# EAGLE design MCB-MTS-Dragonfly-v2.0.0 (EAGLE 7.7.0)

## Sheet 1 of 2
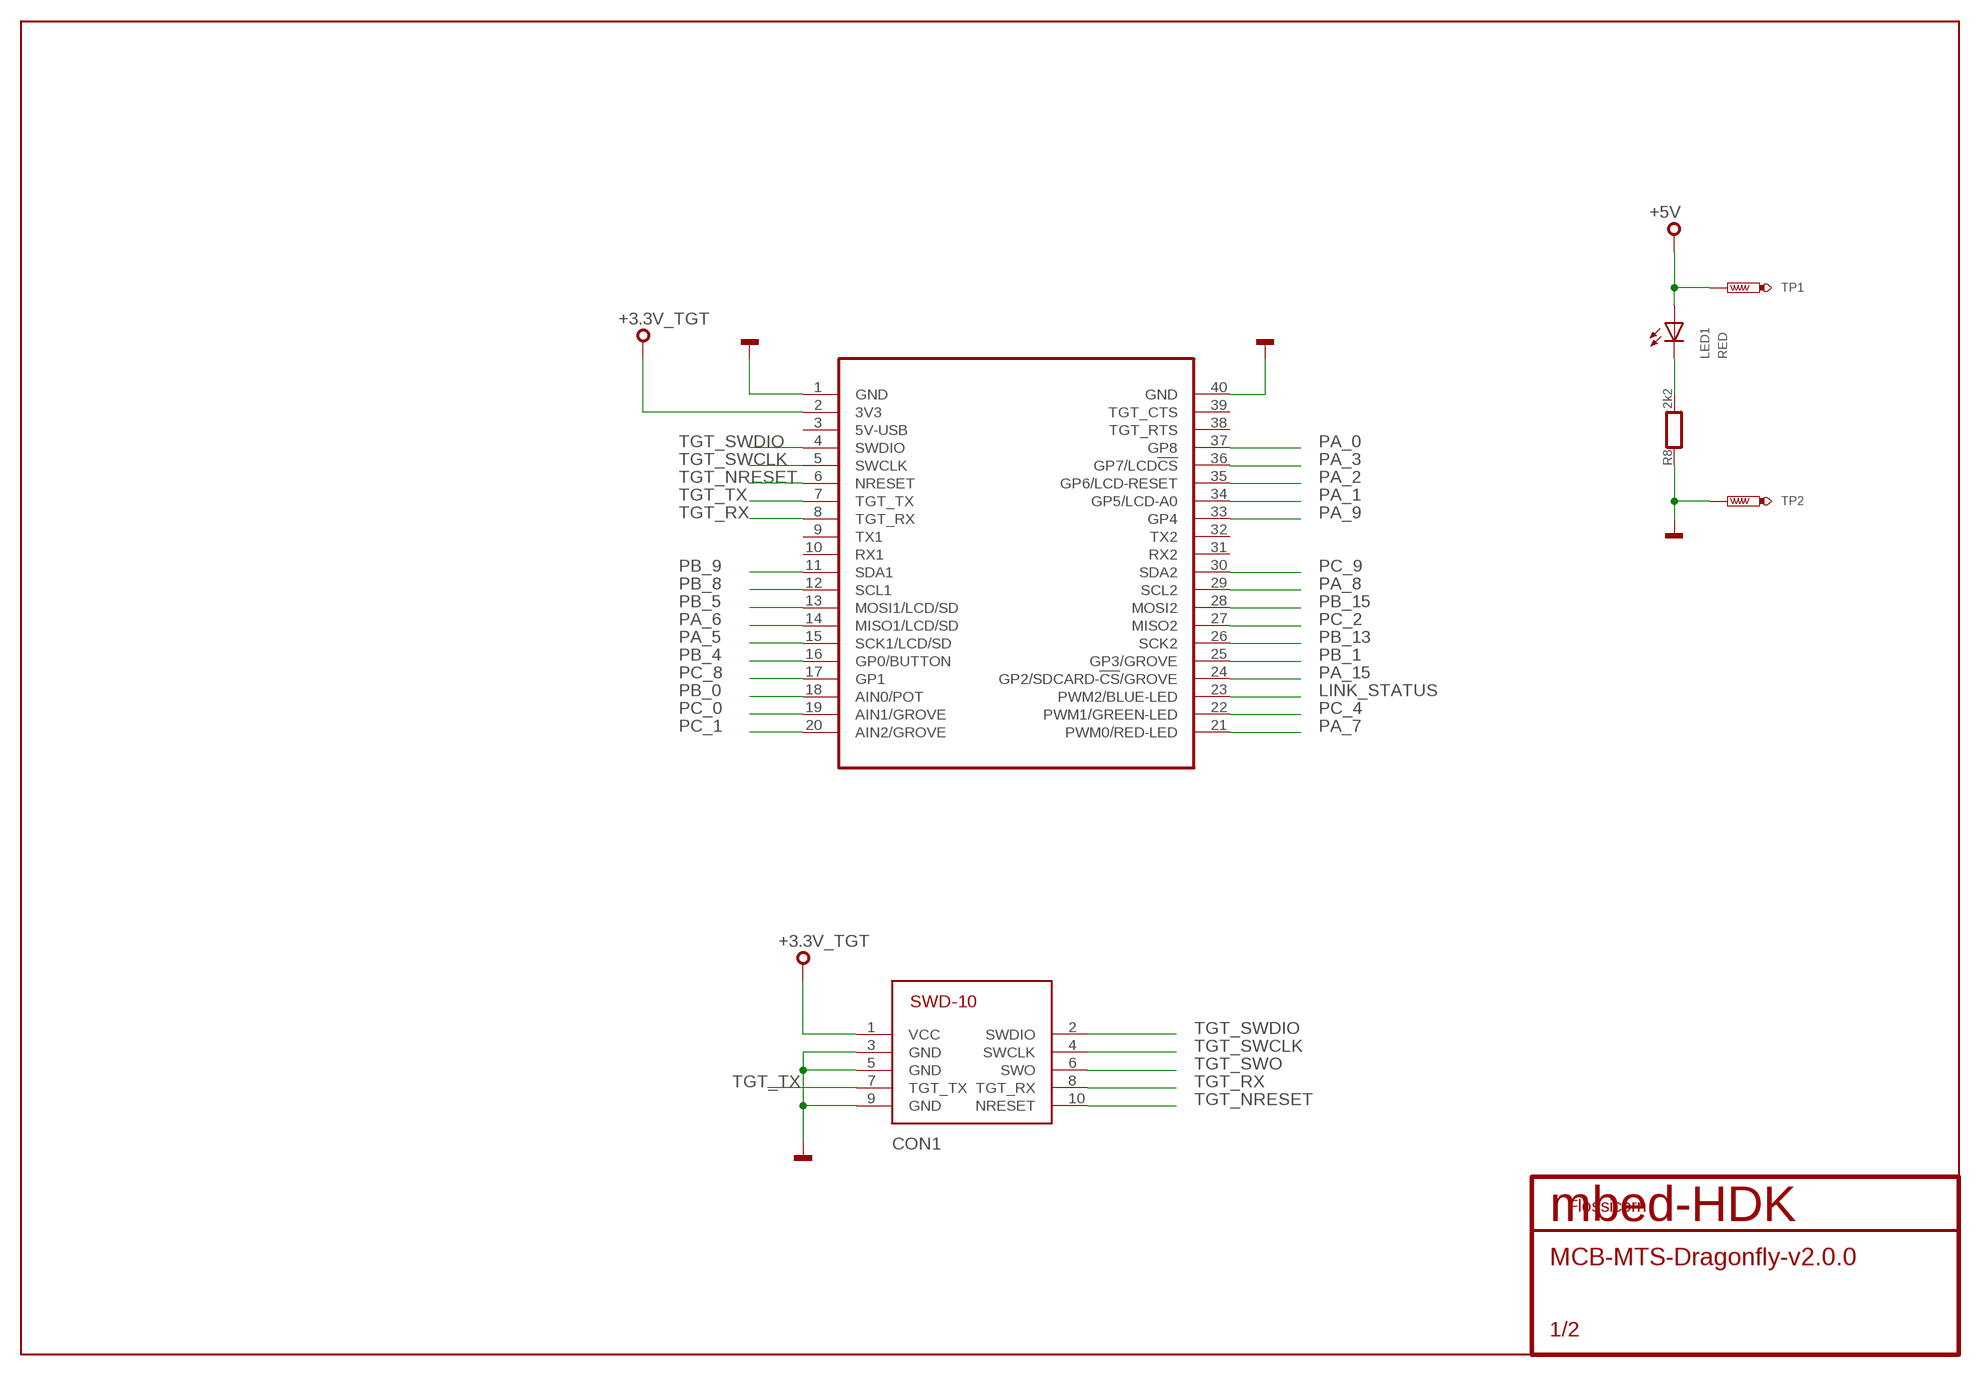
[diagram p0: schematic, sheet 1]

### Parts
CON1  SWD-10/TC2050_SMD  [FTSH-105-02]
LED1  RED  SMD_LED0603  [CHIPLED_0603]
MOD2  MODULE_DAUGHTER  [MODULE_DAUGHTER]
R8  2k2  RESISTOR0603  [0603]
SS1  FLOSSICORN0.5  [FLOSSICORN-0.5]
TP1  TEST-POINT-50R-PTH  [TP50-PTH]
TP2  TEST-POINT-50R-PTH  [TP50-PTH]

### Nets
+3.3V_TGT: CON1.1(VCC) MOD2.2(3V3)
+5V: LED1.A TP1.TP ; also sheet 2
GND: CON1.3(GND) CON1.5(GND) CON1.9(GND) MOD2.1(GND) MOD2.40(GND) R8.1 TP2.TP ; also sheet 2
LINK_STATUS: MOD2.23(PWM2/BLUE-LED) ; also sheet 2
N$1: LED1.C R8.2
PA_0: MOD2.37(GP8) ; also sheet 2
PA_1: MOD2.34(GP5/LCD-A0) ; also sheet 2
PA_2: MOD2.35(GP6/LCD-RESET) ; also sheet 2
PA_3: MOD2.36(GP7/LCD!CS) ; also sheet 2
PA_5: MOD2.15(SCK1/LCD/SD) ; also sheet 2
PA_6: MOD2.14(MISO1/LCD/SD) ; also sheet 2
PA_7: MOD2.21(PWM0/RED-LED) ; also sheet 2
PA_8: MOD2.29(SCL2) ; also sheet 2
PA_9: MOD2.33(GP4) ; also sheet 2
PA_15: MOD2.24(GP2/SDCARD-!CS!/GROVE) ; also sheet 2
PB_0: MOD2.18(AIN0/POT) ; also sheet 2
PB_1: MOD2.25(GP3/GROVE) ; also sheet 2
PB_4: MOD2.16(GP0/BUTTON) ; also sheet 2
PB_5: MOD2.13(MOSI1/LCD/SD) ; also sheet 2
PB_8: MOD2.12(SCL1) ; also sheet 2
PB_9: MOD2.11(SDA1) ; also sheet 2
PB_13: MOD2.26(SCK2) ; also sheet 2
PB_15: MOD2.28(MOSI2) ; also sheet 2
PC_0: MOD2.19(AIN1/GROVE) ; also sheet 2
PC_1: MOD2.20(AIN2/GROVE) ; also sheet 2
PC_2: MOD2.27(MISO2) ; also sheet 2
PC_4: MOD2.22(PWM1/GREEN-LED) ; also sheet 2
PC_8: MOD2.17(GP1) ; also sheet 2
PC_9: MOD2.30(SDA2) ; also sheet 2
TGT_NRESET: CON1.10(NRESET) MOD2.6(NRESET) ; also sheet 2
TGT_RX: CON1.8(TGT_RX) MOD2.8(TGT_RX) ; also sheet 2
TGT_SWCLK: CON1.4(SWCLK) MOD2.5(SWCLK) ; also sheet 2
TGT_SWDIO: CON1.2(SWDIO) MOD2.4(SWDIO) ; also sheet 2
TGT_SWO: CON1.6(SWO) ; also sheet 2
TGT_TX: CON1.7(TGT_TX) MOD2.7(TGT_TX) ; also sheet 2
Unconnected: MOD2.3(5V-USB) MOD2.9(TX1) MOD2.10(RX1) MOD2.31(RX2) MOD2.32(TX2) MOD2.38(TGT_RTS) MOD2.39(TGT_CTS)

## Sheet 2 of 2
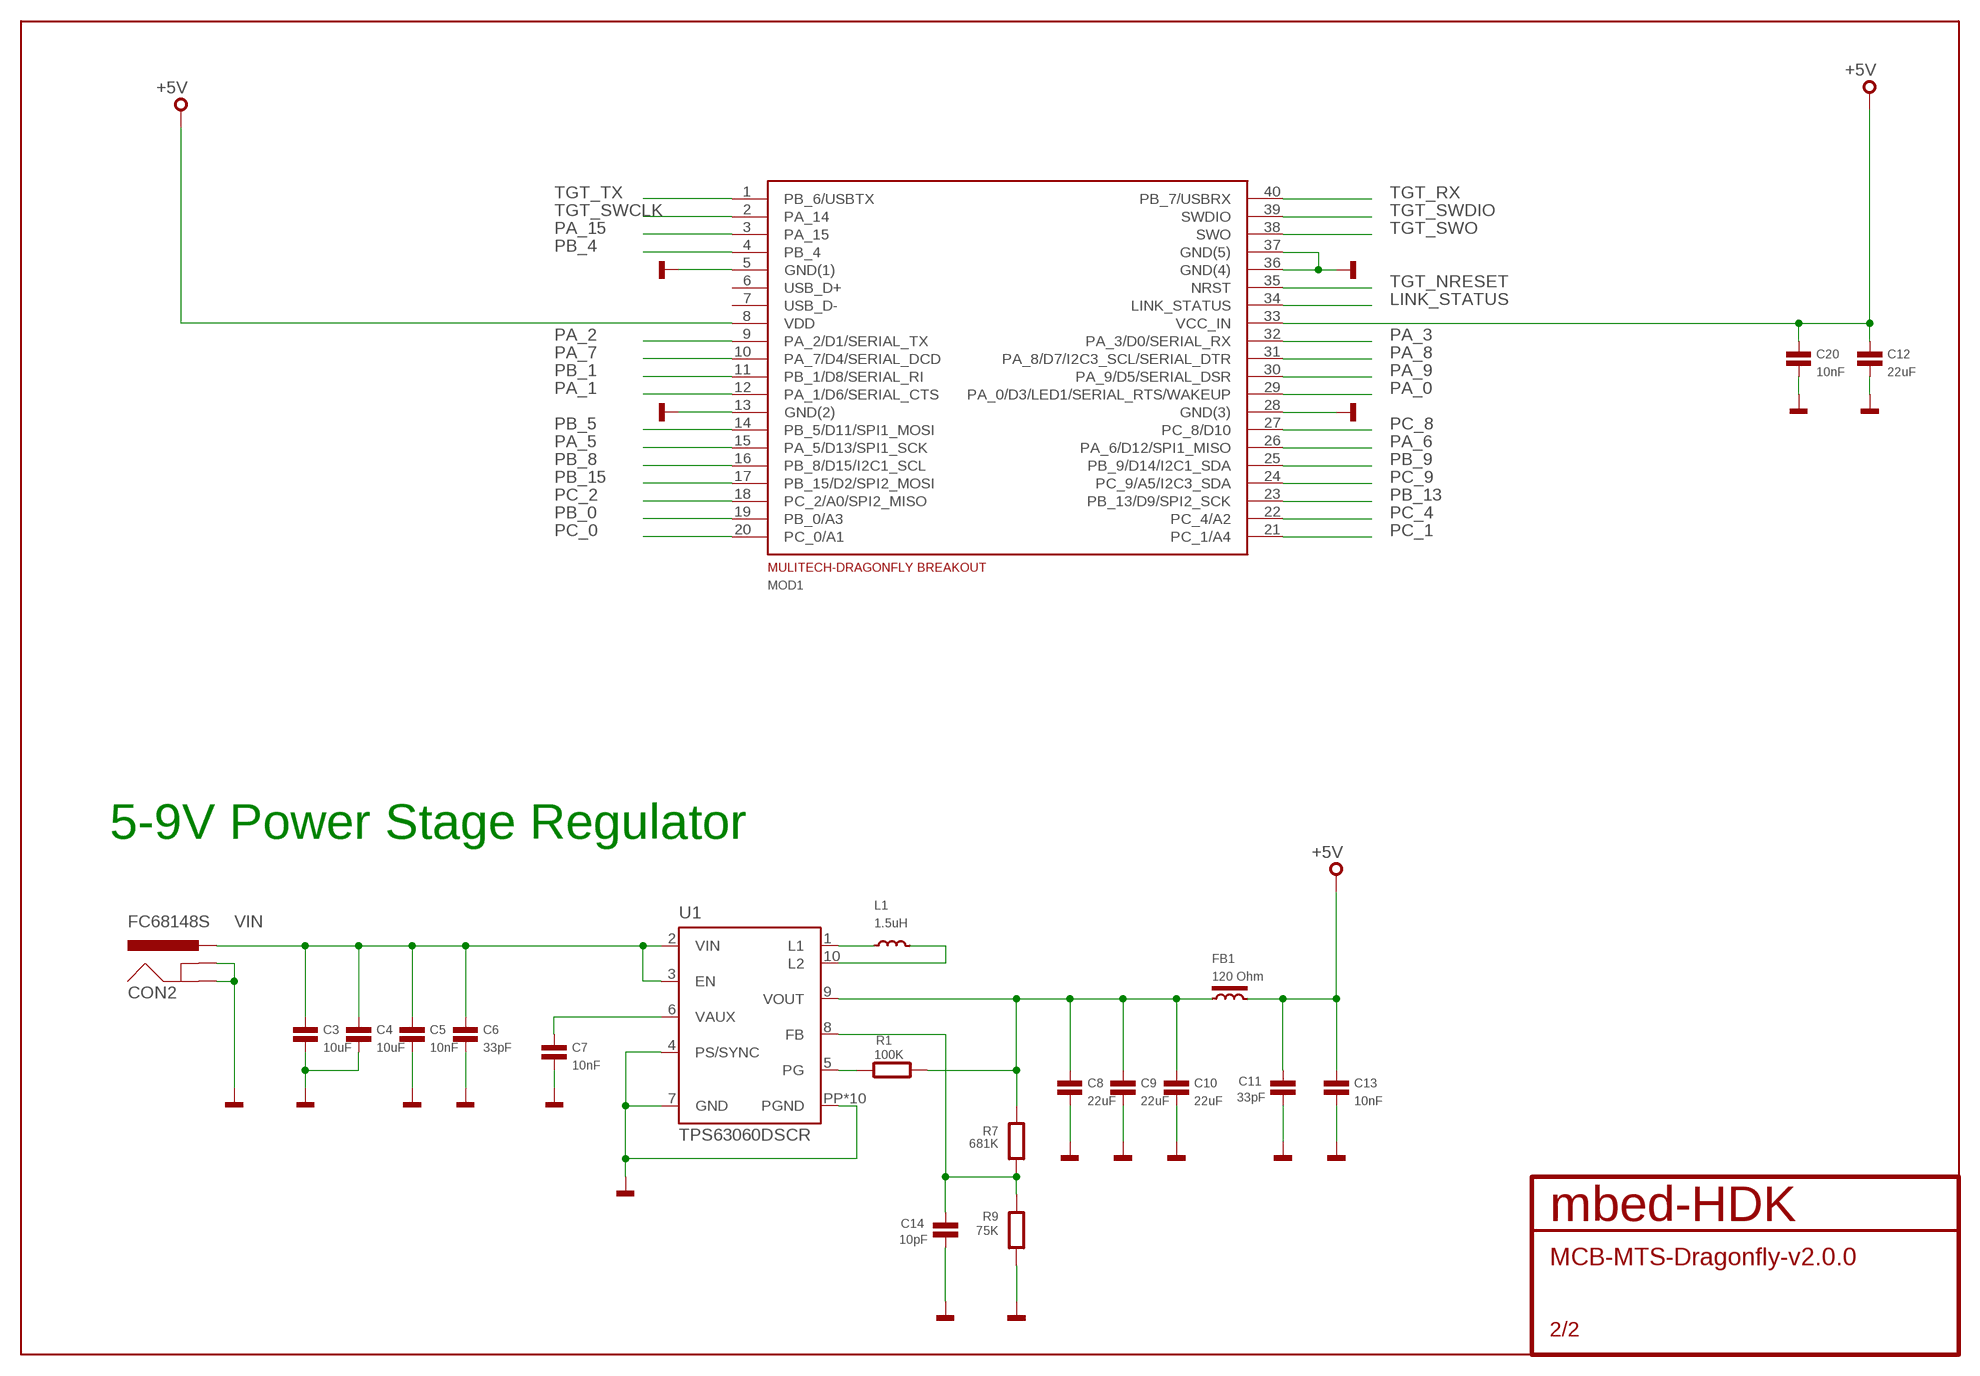
[diagram p1: schematic, sheet 2]

### Parts
C3  10uF  CAPACITOR0603  [0603]
C4  10uF  CAPACITOR0603  [0603]
C5  10nF  CAPACITOR0603  [0603]
C6  33pF  CAPACITOR0603  [0603]
C7  10nF  CAPACITOR0603  [0603]
C8  22uF  CAPACITOR0603  [0603]
C9  22uF  CAPACITOR0603  [0603]
C10  22uF  CAPACITOR0603  [0603]
C11  33pF  CAPACITOR0603  [0603]
C12  22uF  CAPACITOR0603  [0603]
C13  10nF  CAPACITOR0603  [0603]
C14  10pF  CAPACITOR0603  [0603]
C20  10nF  CAPACITOR0603  [0603]
CON2  FC68148S  [FC68148S]
FB1  120 Ohm  FERRITE0603  [0603]
L1  1.5uH  INDUCTORXFL4020  [XFL4020-472MEC]
MOD1  MULITECH-DRAGONFLY-BREAKOUT  [MULITECH-DRAGONFLY-BREAKOUT]
R1  100K  RESISTOR0402  [0402]
R7  681K  RESISTOR0402  [0402]
R9  75K  RESISTOR0402  [0402]
U1  TPS63060DSCR  [DSC-S-PWSON-N10]

### Nets
+5V: C11.1 C12.1 C13.1 C20.1 FB1.2 MOD1.8(VDD) MOD1.33(VCC_IN) ; also sheet 1
GND: C3.2 C4.2 C5.2 C6.2 C7.2 C8.2 C9.2 C10.2 C11.2 C12.2 C13.2 C14.2 C20.2 CON2.2(GNDBREAK) CON2.3(GND) MOD1.5(GND(1)) MOD1.13(GND(2)) MOD1.28(GND(3)) MOD1.36(GND(4)) MOD1.37(GND(5)) R9.1 U1.4(PS/SYNC) U1.7(GND) U1.PP(PGND) U1.PP@1(PGND) U1.PP@2(PGND) U1.PP@3(PGND) U1.PP@4(PGND) U1.PP@5(PGND) U1.PP@7(PGND) U1.PP@8(PGND) U1.PP@9(PGND) U1.PP@10(PGND) ; also sheet 1
LINK_STATUS: MOD1.34(LINK_STATUS) ; also sheet 1
N$17: C7.1 U1.6(VAUX)
N$18: L1.P$1 U1.1(L1)
N$19: L1.P$2 U1.10(L2)
N$20: C14.1 R7.1 R9.2 U1.8(FB)
N$21: C8.1 C9.1 C10.1 FB1.1 R1.2 R7.2 U1.9(VOUT)
N$23: R1.1 U1.5(PG)
PA_0: MOD1.29(PA_0/D3/LED1/SERIAL_RTS/WAKEUP) ; also sheet 1
PA_1: MOD1.12(PA_1/D6/SERIAL_CTS) ; also sheet 1
PA_2: MOD1.9(PA_2/D1/SERIAL_TX) ; also sheet 1
PA_3: MOD1.32(PA_3/D0/SERIAL_RX) ; also sheet 1
PA_5: MOD1.15(PA_5/D13/SPI1_SCK) ; also sheet 1
PA_6: MOD1.26(PA_6/D12/SPI1_MISO) ; also sheet 1
PA_7: MOD1.10(PA_7/D4/SERIAL_DCD) ; also sheet 1
PA_8: MOD1.31(PA_8/D7/I2C3_SCL/SERIAL_DTR) ; also sheet 1
PA_9: MOD1.30(PA_9/D5/SERIAL_DSR) ; also sheet 1
PA_15: MOD1.3(PA_15) ; also sheet 1
PB_0: MOD1.19(PB_0/A3) ; also sheet 1
PB_1: MOD1.11(PB_1/D8/SERIAL_RI) ; also sheet 1
PB_4: MOD1.4(PB_4) ; also sheet 1
PB_5: MOD1.14(PB_5/D11/SPI1_MOSI) ; also sheet 1
PB_8: MOD1.16(PB_8/D15/I2C1_SCL) ; also sheet 1
PB_9: MOD1.25(PB_9/D14/I2C1_SDA) ; also sheet 1
PB_13: MOD1.23(PB_13/D9/SPI2_SCK) ; also sheet 1
PB_15: MOD1.17(PB_15/D2/SPI2_MOSI) ; also sheet 1
PC_0: MOD1.20(PC_0/A1) ; also sheet 1
PC_1: MOD1.21(PC_1/A4) ; also sheet 1
PC_2: MOD1.18(PC_2/A0/SPI2_MISO) ; also sheet 1
PC_4: MOD1.22(PC_4/A2) ; also sheet 1
PC_8: MOD1.27(PC_8/D10) ; also sheet 1
PC_9: MOD1.24(PC_9/A5/I2C3_SDA) ; also sheet 1
TGT_NRESET: MOD1.35(NRST) ; also sheet 1
TGT_RX: MOD1.40(PB_7/USBRX) ; also sheet 1
TGT_SWCLK: MOD1.2(PA_14) ; also sheet 1
TGT_SWDIO: MOD1.39(SWDIO) ; also sheet 1
TGT_SWO: MOD1.38(SWO) ; also sheet 1
TGT_TX: MOD1.1(PB_6/USBTX) ; also sheet 1
VIN: C3.1 C4.1 C5.1 C6.1 CON2.1-1(PWR) CON2.1-2(PWR) U1.2(VIN) U1.3(EN)
Unconnected: MOD1.6(USB_D+) MOD1.7(USB_D-)

### Notes on the sheet
- 5-9V Power Stage Regulator

## Library data of the parts
C3-C14 C20 = mbed-HDK-RLCQ:CAPACITOR: Capacitor
CON1 = mbed-HDK-Connector:SWD-10/TC2050: 1mm pitch 10-Pin Cortex Programming Header with optional TC2050 footprint solderless interchangeable
CON2 = blackbriar:FC68148S: Power Jack This is the standard 5.5mm barrel jack for power. The PTH is the most common, proven, reliable, footprint. The Slot footprint only works if the mill layer is transmitted to the PCB fab house so be warned. Mating wall wart : TOL-00298 (and others)
FB1 = mbed-HDK-RLCQ:FERRITE: Ferrite Bead
L1 = mbed-HDK-RLCQ:INDUCTOR: Inductor
LED1 = mbed-HDK-Optical:SMD_LED: LED SMD, Colour Red; MF: Wurth Electronics Inc; MFN: 150060RS75000; OC-DIGIKEY: 732-4978-1-ND; OC-MOUSER: 710-150060RS75000; OC-NEWARK: 2322071
MOD1 = blackbriar:MULITECH-DRAGONFLY-BREAKOUT: Breakout for Multitech Dragonfly; MF: Hirose; MFN: DF17(2.0)-40DP-0.5V(57); OC-DIGIKEY: H11130CT-ND; OC-MOUSER: 798-DF172040DP05V57; OC-NEWARK: 2300341
MOD2 = blackbriar:MODULE_DAUGHTER
R1 R7 R9 = mbed-HDK-RLCQ:RESISTOR: Resistor
R8 = mbed-HDK-RLC:RESISTOR: Resistor
SS1 = blackbriar:FLOSSICORN
TP1 TP2 = mbed-HDK:TEST-POINT
U1 = mbed-HDK-Power:TPS63060DSCR: Buck Boost Conveter (2.5V-12Vin, 2.5V-8Vout, 2Aout); MF: TEXAS INSTRUMENTS; MFN: TPS63060DSCR; OC-DIGIKEY: 296-30204-1-ND; OC-MOUSER: 595-TPS63060DSCR; OC-NEWARK: 76T8143

## Board
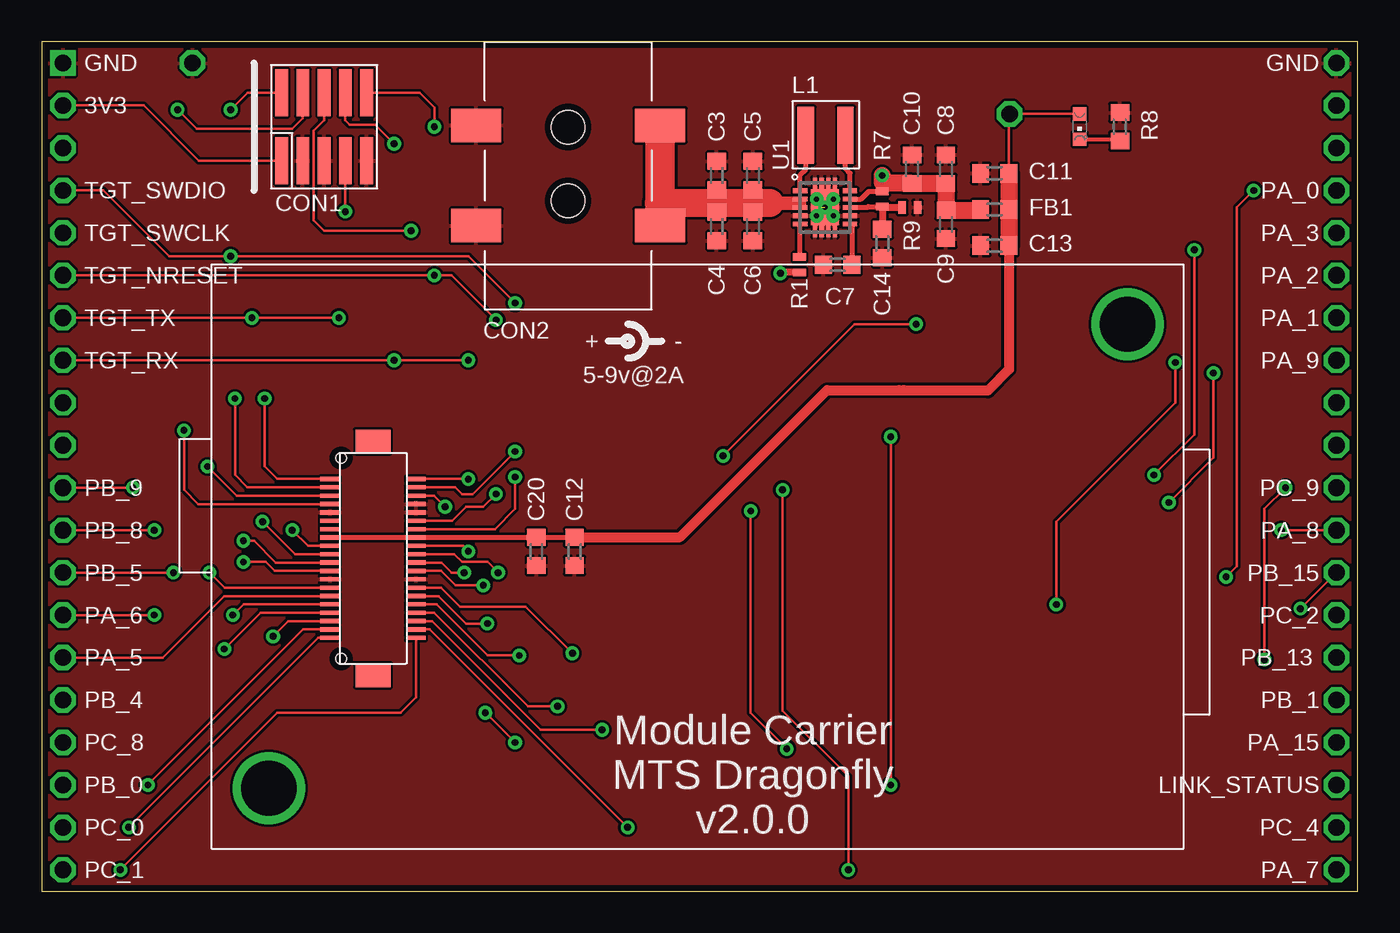
[diagram p2: board, top side]
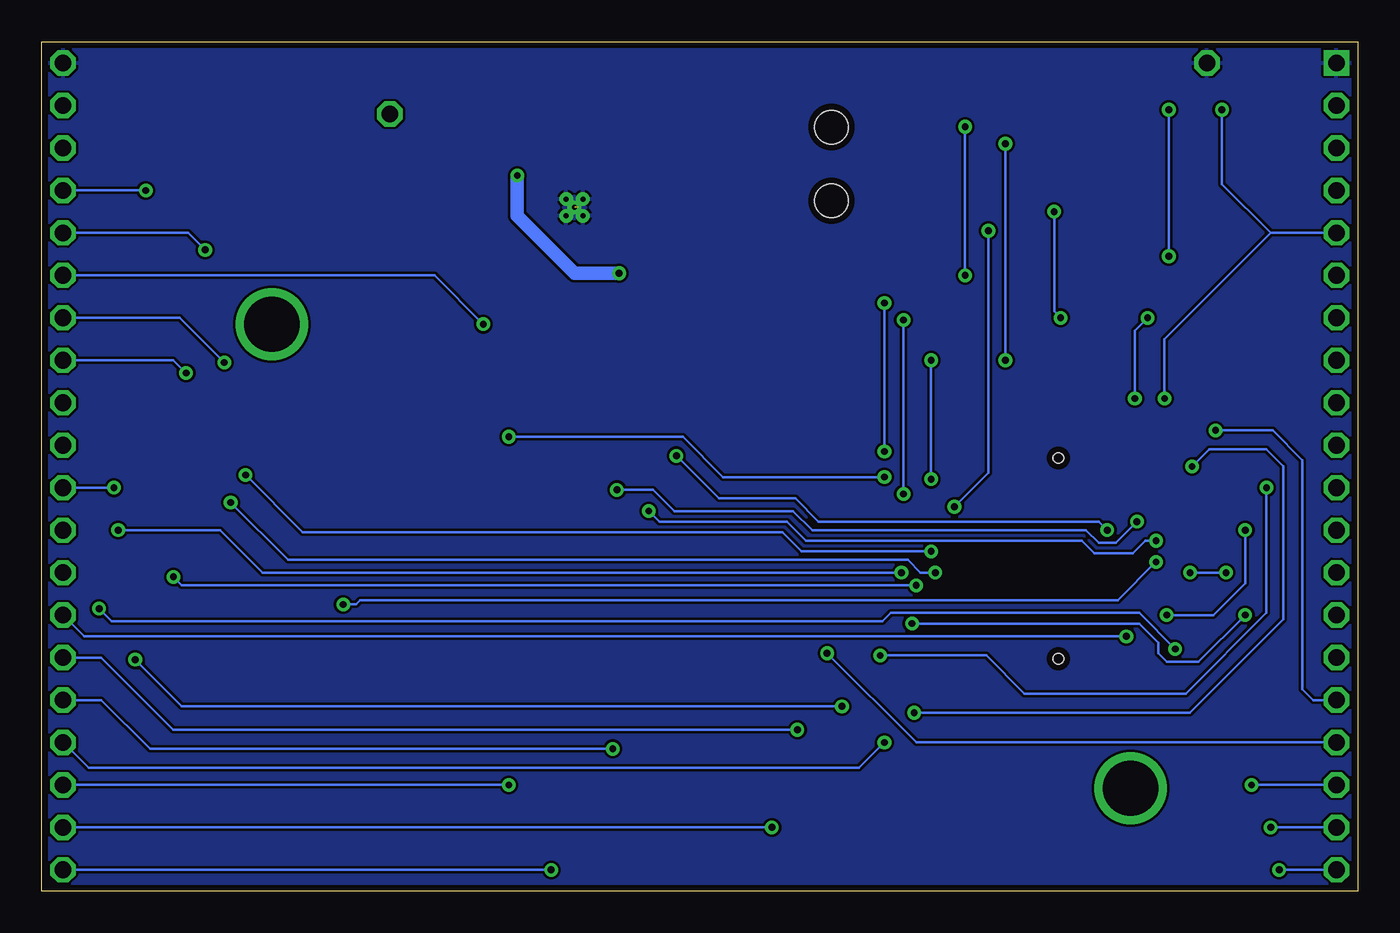
[diagram p3: board, bottom side, seen from below]

Size 78.74 x 50.8 mm. Coordinates in mm from the lower left corner, seen from the top.
Copper layers ((1*16)): Top 0.035mm / dielectric 0.8mm / Bottom 0.035mm
Design rules "mbed-HDK-6-6-2-layer": minimum track width 6mil, minimum drill 9mil, track to track 6mil, track to pad 6mil, pad to pad 6mil, via to via 6mil, smd to smd 6mil, copper to edge 15mil, drill to drill 8mil, minimum pad ring 10mil, minimum via ring 8mil, stop-mask expansion 4mil, vias tented up to drill 0mil, thermal gap 6mil

### Footprints (pad centres in the part's own frame; a part is rotated, then mirrored left to right if it is on the bottom)
0603 = smd 1 x 1.1: 1 -0.85,0; 2 0.85,0
FTSH-105-02 = smd 0.762 x 2.794: 1 0.381,-2.032; 2 0.381,2.032; 3 1.651,-2.032; 4 1.651,2.032; 5 2.921,-2.032; 6 2.921,2.032; 7 4.191,-2.032; 8 4.191,2.032; 9 5.461,-2.032; 10 5.461,2.032
FC68148S = smd 3 x 2: 1-1 5.5,-5; 1-2 5.5,-11; 2 -5.5,-11; 3 -5.5,-5 | hole 2: 0,-5.1; 0,-9.5
XFL4020-472MEC = smd 0.98 x 3.4: P$1 0,0; P$2 2.37,0
CHIPLED_0603 = smd 0.8 x 0.8: A 0,-0.75; C 0,0.75
MULITECH-DRAGONFLY-BREAKOUT = smd 0.25 x 1.15: 1 -22.11,7.08; 2 -21.61,7.08; 3 -21.11,7.08; 4 -20.61,7.08; 5 -20.11,7.08; 6 -19.61,7.08; 7 -19.11,7.08; 8 -18.61,7.08; 9 -18.11,7.08; 10 -17.61,7.08; 11 -17.11,7.08; 12 -16.61,7.08; 13 -16.11,7.08; 14 -15.61,7.08; 15 -15.11,7.08; 16 -14.61,7.08; 17 -14.11,7.08; 18 -13.61,7.08; 19 -13.11,7.08; 20 -12.61,7.08; 21 -12.61,12.23; 22 -13.11,12.23; 23 -13.61,12.23; 24 -14.11,12.23; 25 -14.61,12.23; 26 -15.11,12.23; 27 -15.61,12.23; 28 -16.11,12.23; 29 -16.61,12.23; 30 -17.11,12.23; 31 -17.61,12.23; 32 -18.11,12.23; 33 -18.61,12.23; 34 -19.11,12.23; 35 -19.61,12.23; 36 -20.11,12.23; 37 -20.61,12.23; 38 -21.11,12.23; 39 -21.61,12.23; 40 -22.11,12.23 | drill 3.3: P$1 -31.37,54.81; P$2 -3.61,3.43 | smd 1.4 x 2.1: P$43 -24.36,9.655; P$44 -10.36,9.655 | hole 0.6: -11.36,7.755; -23.36,7.755
MODULE_DAUGHTER = drill 1 square: 1 0,0 | drill 1 octagon: 2 0,-2.54; 3 0,-5.08; 4 0,-7.62; 5 0,-10.16; 6 0,-12.7; 7 0,-15.24; 8 0,-17.78; 9 0,-20.32; 10 0,-22.86; 11 0,-25.4; 12 0,-27.94; 13 0,-30.48; 14 0,-33.02; 15 0,-35.56; 16 0,-38.1; 17 0,-40.64; 18 0,-43.18; 19 0,-45.72; 20 0,-48.26; 21 76.2,-48.26; 22 76.2,-45.72; 23 76.2,-43.18; 24 76.2,-40.64; 25 76.2,-38.1; 26 76.2,-35.56; 27 76.2,-33.02; 28 76.2,-30.48; 29 76.2,-27.94; 30 76.2,-25.4; 31 76.2,-22.86; 32 76.2,-20.32; 33 76.2,-17.78; 34 76.2,-15.24; 35 76.2,-12.7; 36 76.2,-10.16; 37 76.2,-7.62; 38 76.2,-5.08; 39 76.2,-2.54; 40 76.2,0
0402 = smd 0.457 x 0.762: 1 -0.457,0; 2 0.457,0
TP50-PTH = drill 1 octagon: TP 0,0
DSC-S-PWSON-N10 = smd 0.85 x 0.28: 1 -1.488,1; 2 -1.488,0.5; 3 -1.488,0; 4 -1.488,-0.5; 5 -1.488,-1; 6 1.5,-1; 7 1.5,-0.5; 8 1.5,0; 9 1.5,0.5; 10 1.5,1 | smd 1.7 x 2.15: PP 0,0 | smd 0.25 x 3.55: PP@1 0.6,0; PP@2 0.2,0; PP@3 -0.2,0; PP@4 -0.6,0 | drill 0.3 pad 0.4: PP@5 0.5,0.5; PP@7 0,0; PP@8 0.5,-0.5; PP@9 -0.5,0.5; PP@10 -0.5,-0.5

### Placement (x,y rotation side)
C3  40.39,42.8 90 top
C4  40.39,39.75 270 top
C5  42.55,39.75 270 top
C6  42.55,42.8 90 top
C7  47.62,37.47 180 top
C8  54.1,43.18 90 top
C9  54.1,39.88 270 top
C10  52.07,43.18 90 top
C11  57.02,42.93 180 top
C12  31.88,20.32 270 top
C13  57.02,38.61 180 top
C14  50.29,38.73 270 top
C20  29.59,20.32 270 top
CON1  13.97,45.72 0 top
CON2  31.5,50.8 0 top
FB1  57.02,40.77 0 top
L1  45.72,45.21 0 top
LED1  62.1,45.72 180 top
MOD1  10.16,2.54 270 top
MOD2  1.27,49.53 0 top
R1  45.34,37.47 270 top
R7  50.29,41.4 90 top
R8  64.52,45.72 270 top
R9  51.94,40.89 180 top
SS1  56.77,2.79 0 top
TP1  57.91,46.48 0 top
TP2  9.02,49.53 0 top
U1  46.86,40.89 0 top

### Tracks (layer width: path | path; a pad name or v marks a point on that pad's centre or on a via)
+3.3V_TGT
  Top 0.152: CON1.1 9.4,43.69 6.1,46.99 MOD2.2
+5V
  Top 0.152: C11.1 57.87,46.44 TP1.TP 62.09,46.48 LED1.A
  Top 0.305: C12.1 C20.1 26.65,21.15 MOD1.33 MOD1.8
  Top 0.61: C13.1 57.87,31.2 56.64,29.97 | 56.64,29.97 56.6,29.93 | 56.64,29.97 51.56,29.97 51.31,29.97 46.99,29.97 38.19,21.17 C12.1
  Top 1.016: C11.1 FB1.2 C13.1
GND  (1 unrouted)
  pour Bottom: 0,0 78.74,0 78.74,50.8 0,50.8
  pour Top: 0,0 78.74,0 78.74,50.8 0,50.8
LINK_STATUS  (via drill 0.41)
  Top 0.152: MOD1.34 27.11,21.65 28.32,22.86 v28.32,24.77 | v50.8,6.35 v50.8,27.18
  Bottom 0.152: v28.32,24.77 37.97,24.77 40.39,27.18 v50.8,27.18 | MOD2.23 v50.8,6.35
N$1
  Top 0.254: LED1.C 64.52,44.97 R8.2
N$17
  Top 0.305: U1.6 48.48,39.78 C7.1
N$18
  Top 0.305: U1.1 45.38,42.84 45.72,43.18 L1.P$1
N$19
  Top 0.305: U1.10 48.36,42.95 48.09,43.22 L1.P$2
N$20
  Top 0.305: U1.8 49.4,40.89 49.45,40.95 R7.1
  Top 0.406: C14.1 R7.1 50.34,40.89 R9.2
N$21  (via drill 0.41)
  Top 0.305: U1.9 49.01,41.39 49.48,41.86 R7.2 50.29,42.42
  Top 0.406: R1.2 44.25,37.01 v44.2,36.96
  Top 1.016: v50.29,42.8 50.29,42.42 50.38,42.33 C10.1 C8.1 C9.1 56.13,40.73 FB1.1
  Bottom 0.813: v50.29,42.8 50.29,40.39 46.86,36.96 v44.2,36.96
N$23
  Top 0.305: U1.5 45.34,39.86 R1.1
PA_0  (via drill 0.41)
  Top 0.152: MOD1.29 23.9,19.15 24.77,18.29 v26.42,18.29 | v70.87,18.8 71.5,19.43 71.5,40.89 v72.52,41.91
  Bottom 0.152: v26.42,18.29 70.36,18.29 v70.87,18.8 | v72.52,41.91 MOD2.37
PA_1  (via drill 0.41)
  Top 0.152: MOD1.12 13.94,19.15 13.41,19.69 v12.06,19.69 | v67.82,31.62 67.82,29.21 60.71,22.1 v60.71,17.15
  Bottom 0.152: MOD2.34 70.48,34.29 v67.82,31.62 | v60.71,17.15 59.94,17.15 59.69,17.4 14.35,17.4 v12.06,19.69
PA_2  (via drill 0.41)
  Top 0.152: MOD1.9 15.93,20.65 v14.99,21.59 | v40.77,26.04 48.64,33.91 v52.32,33.91
  Bottom 0.152: v14.99,21.59 15.49,22.1 32.26,22.1 33.66,23.5 38.23,23.5 v40.77,26.04 | v52.32,33.91 55.25,36.83 MOD2.35
PA_3  (via drill 0.41)
  Top 0.152: MOD1.32 25.2,20.65 v25.53,20.32 | v68.96,38.35 68.96,27.3 v66.55,24.89
  Bottom 0.152: v25.53,20.32 33.27,20.32 34.42,21.46 63.12,21.46 v66.55,24.89 | MOD2.36 69.98,39.37 v68.96,38.35
PA_5
  Top 0.152: MOD1.15 10.92,17.65 7.24,13.97 MOD2.15
PA_6  (via drill 0.41)
  Top 0.152: MOD1.26 23.75,17.65 25.4,16 v26.67,16 | MOD2.14 v6.73,16.51
  Bottom 0.152: v6.73,16.51 9.53,13.72 11.43,13.72 11.94,14.22 11.94,14.86 13.08,16 v26.67,16
PA_7  (via drill 0.41)
  Top 0.152: MOD1.10 15.16,20.15 v13.21,22.1 | v44.32,24 44.32,10.8 48.26,6.86 v48.26,1.27
  Bottom 0.152: v13.21,22.1 14.48,20.83 15.49,20.83 16.26,21.59 32.64,21.59 33.78,22.73 40.89,22.73 42.16,24 v44.32,24 | v48.26,1.27 MOD2.21
PA_8  (via drill 0.41)
  Top 0.152: v27.3,19.05 26.67,19.69 25.15,19.69 24.68,20.15 MOD1.31 | v74.17,21.59 MOD2.29
  Bottom 0.152: v27.3,19.05 65.53,19.05 68.07,21.59 v74.17,21.59
PA_9  (via drill 0.41)
  Top 0.152: MOD1.30 23.91,19.65 24.51,19.05 v25.27,19.05 | v70.1,30.99 70.1,25.91 v67.44,23.24
  Bottom 0.152: v25.27,19.05 26.16,19.05 26.92,19.81 64.01,19.81 v67.44,23.24 | MOD2.33 70.87,31.75 v70.1,30.99
PA_15  (via drill 0.41)
  Top 0.152: MOD1.3 11.66,23.65 v9.91,25.4 | v28.32,8.89 v26.54,10.67
  Bottom 0.152: MOD2.24 75.95,7.37 29.84,7.37 v28.32,8.89 | v26.54,10.67 10.03,10.67 4.45,16.26 4.45,25.4 5.46,26.42 8.89,26.42 v9.91,25.4
PB_0  (via drill 0.41)
  Top 0.152: MOD1.19 15.65,15.65 v6.35,6.35
  Bottom 0.152: v6.35,6.35 MOD2.18
PB_1  (via drill 0.41)
  Top 0.152: MOD1.11 14,19.65 12.7,20.96 v12.06,20.96 | v42.42,22.73 42.42,10.67 v44.58,8.51
  Bottom 0.152: v12.06,20.96 12.7,20.96 13.46,20.19 15.75,20.19 16.51,20.96 33.02,20.96 34.16,22.1 41.78,22.1 v42.42,22.73 | MOD2.25 75.18,11.43 72.26,8.51 v44.58,8.51
PB_4  (via drill 0.41)
  Top 0.152: MOD1.4 9.36,23.15 8.51,24 v8.51,27.56
  Bottom 0.152: MOD2.16 2.67,11.43 3.3,12.06 3.3,25.78 5.08,27.56 v8.51,27.56
PB_5  (via drill 0.41)
  Top 0.152: MOD1.14 10.93,18.15 v10.03,19.05 | MOD2.13 v7.87,19.05
  Bottom 0.152: v7.87,19.05 v10.03,19.05
PB_8  (via drill 0.41)
  Top 0.152: MOD1.16 12.07,17.15 v11.43,16.51 | MOD2.12 v6.73,21.59
  Bottom 0.152: v11.43,16.51 8.64,16.51 6.73,18.42 v6.73,21.59
PB_9  (via drill 0.41)
  Top 0.152: MOD1.25 23.62,17.15 26.67,14.1 v28.57,14.1 | v5.46,24.13 MOD2.11
  Bottom 0.152: v28.57,14.1 22.22,14.1 19.94,11.81 10.29,11.81 5.46,16.64 v5.46,24.13
PB_13  (via drill 0.41)
  Top 0.152: MOD1.23 23.35,16.15 29.84,9.65 v33.53,9.65
  Bottom 0.152: v33.53,9.65 70.87,9.65 75.18,13.97 MOD2.26
PB_15  (via drill 0.41)
  Top 0.152: MOD1.17 13.09,16.65 v10.92,14.48 | MOD2.28 v75.31,16.89
  Bottom 0.152: v10.92,14.48 13.08,16.64 27.94,16.64 28.45,16.13 74.55,16.13 v75.31,16.89
PC_0  (via drill 0.41)
  Top 0.152: MOD1.20 16.55,15.15 v5.21,3.81
  Bottom 0.152: v5.21,3.81 MOD2.19
PC_1  (via drill 0.41)
  Top 0.152: MOD1.21 22.39,11.59 21.46,10.67 14.1,10.67 v4.7,1.27
  Bottom 0.152: v4.7,1.27 MOD2.20
PC_2  (via drill 0.41)
  Top 0.152: MOD1.18 14.75,16.15 v13.84,15.24
  Bottom 0.152: MOD2.27 76.2,15.24 v13.84,15.24
PC_4  (via drill 0.41)
  Top 0.152: MOD1.22 23.21,15.65 v35.05,3.81
  Bottom 0.152: v35.05,3.81 MOD2.22
PC_8  (via drill 0.41)
  Top 0.152: MOD1.27 23.89,18.15 25.02,17.02 28.96,17.02 v31.75,14.22
  Bottom 0.152: v31.75,14.22 26.42,8.89 MOD2.17
PC_9  (via drill 0.41)
  Top 0.152: MOD1.24 23.48,16.65 29.08,11.05 v30.86,11.05 | v73.15,13.84 73.15,22.86 v74.42,24.13
  Bottom 0.152: v74.42,24.13 MOD2.30 | v30.86,11.05 70.36,11.05 v73.15,13.84
TGT_NRESET  (via drill 0.41)
  Top 0.152: MOD2.6 v23.5,36.83 24.51,36.83 v27.18,34.16 | MOD1.35 24.56,22.15 25.4,22.99 26.42,22.99 v27.18,23.75 | v23.5,45.72 23.5,46.86 22.61,47.75 CON1.10
  Bottom 0.152: v27.18,23.75 v27.18,34.16 | v23.5,45.72 v23.5,36.83
TGT_RX  (via drill 0.41)
  Top 0.152: MOD2.8 v21.08,31.75 v25.53,31.75 | MOD1.40 25.52,24.65 v25.53,24.64 | CON1.8 18.16,46.1 18.41,45.85 19.94,45.85 v21.08,44.7
  Bottom 0.152: v25.53,24.64 v25.53,31.75 | v21.08,44.7 v21.08,31.75
TGT_SWCLK  (via drill 0.41)
  Top 0.152: MOD1.2 12.81,24.15 12.3,24.15 11.56,24.89 v11.56,29.46 | CON1.4 15.62,46.23 14.99,45.59 9.27,45.59 v8.13,46.74
  Bottom 0.152: v11.56,29.46 11.56,33.02 5.21,39.37 | 5.21,39.37 MOD2.5 | v8.13,46.74 8.13,42.29 5.21,39.37
TGT_SWDIO  (via drill 0.41)
  Top 0.152: MOD2.4 3.68,41.91 7.62,37.97 v11.3,37.97 25.53,37.97 v28.32,35.18 | MOD1.39 24.75,24.15 25.15,23.75 25.78,23.75 v28.32,26.29 | CON1.2 12.32,47.75 v11.3,46.74
  Bottom 0.152: v11.3,46.74 v11.3,37.97 | v28.32,35.18 v28.32,26.29
TGT_SWO  (via drill 0.41)
  Top 0.152: MOD1.38 23.47,23.65 v24.13,22.99 | CON1.6 16.89,46.1 16.26,45.47 16.26,40.13 16.89,39.5 v22.1,39.5
  Bottom 0.152: v22.1,39.5 22.1,25.02 v24.13,22.99
TGT_TX  (via drill 0.41)
  Top 0.152: MOD1.1 14.08,24.65 13.33,25.4 v13.33,29.46 | MOD2.7 v12.57,34.29 v17.78,34.29 | CON1.7 v18.16,40.64
  Bottom 0.152: v13.33,29.46 13.33,33.53 v12.57,34.29 | v18.16,40.64 18.16,34.67 v17.78,34.29
VIN
  Top 0.254: U1.2 U1.3 45.38,41.15 45.34,41.15 | 42.68,41.11 43.05,41.11 43.05,41.95 C6.1 | 42.68,41.11 40.26,41.13 | 40.26,41.13 36.96,41.15 | 43.35,41.15 43.56,41.15 | C4.1 C3.1 40.26,41.95 40.26,41.13 | C5.1 42.68,40.6 42.68,41.11
  Top 0.813: 45.34,41.15 43.56,41.15
  Top 1.676: 43.56,41.15 36.96,41.15
  Top 1.778: CON2.1-1 CON2.1-2 37,41.15 36.96,41.15

### Text on the board
tPlace: GND / 3V3 / / TGT_SWDIO / TGT_SWCLK / TGT_NRESET / TGT_TX / TGT_RX / / / PB_9 / PB_8 / PB_5 / PA_6 / PA_5 / PB_4 / PC_8 / PB_0 / PC_0 / PC_1 | GND / / / PA_0 / PA_3 / PA_2 / PA_1 / PA_9 / / / PC_9 / PA_8 / PB_15 / PC_2 / PB_13 / PB_1 / PA_15 / LINK_STATUS / PC_4 / PA_7 | + | - | 5-9v@2A | Module Carrier / MTS Dragonfly / v2.0.0